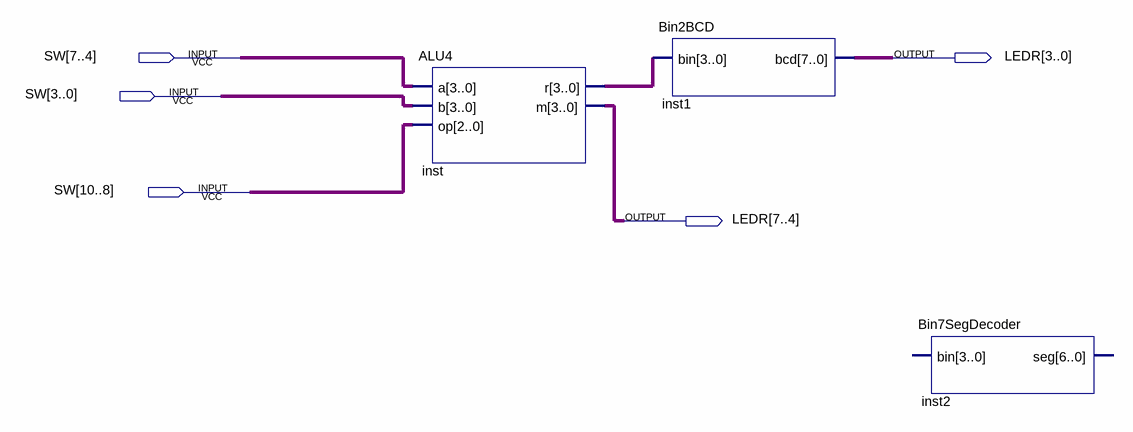
[diagram p0: schematic sheet]
// Quartus schematic ALUDemo.bdf as structural Verilog: 3 symbols, 5 pins
module ALUDemo (
  input  [10:0] SW,
  output [7:0] LEDR
);

  wire [3:0] inst_r;

  ALU4 inst (.a(SW[7:4]), .b(SW[3:0]), .op(SW[10:8]), .r(inst_r), .m(LEDR[7:4]));
  Bin2BCD inst1 (.bin(inst_r), .bcd(LEDR[3:0]));
  Bin7SegDecoder inst2 ();  // open: bin, seg
endmodule
